# EAGLE schematic robotdriver (EAGLE 8.3.2)
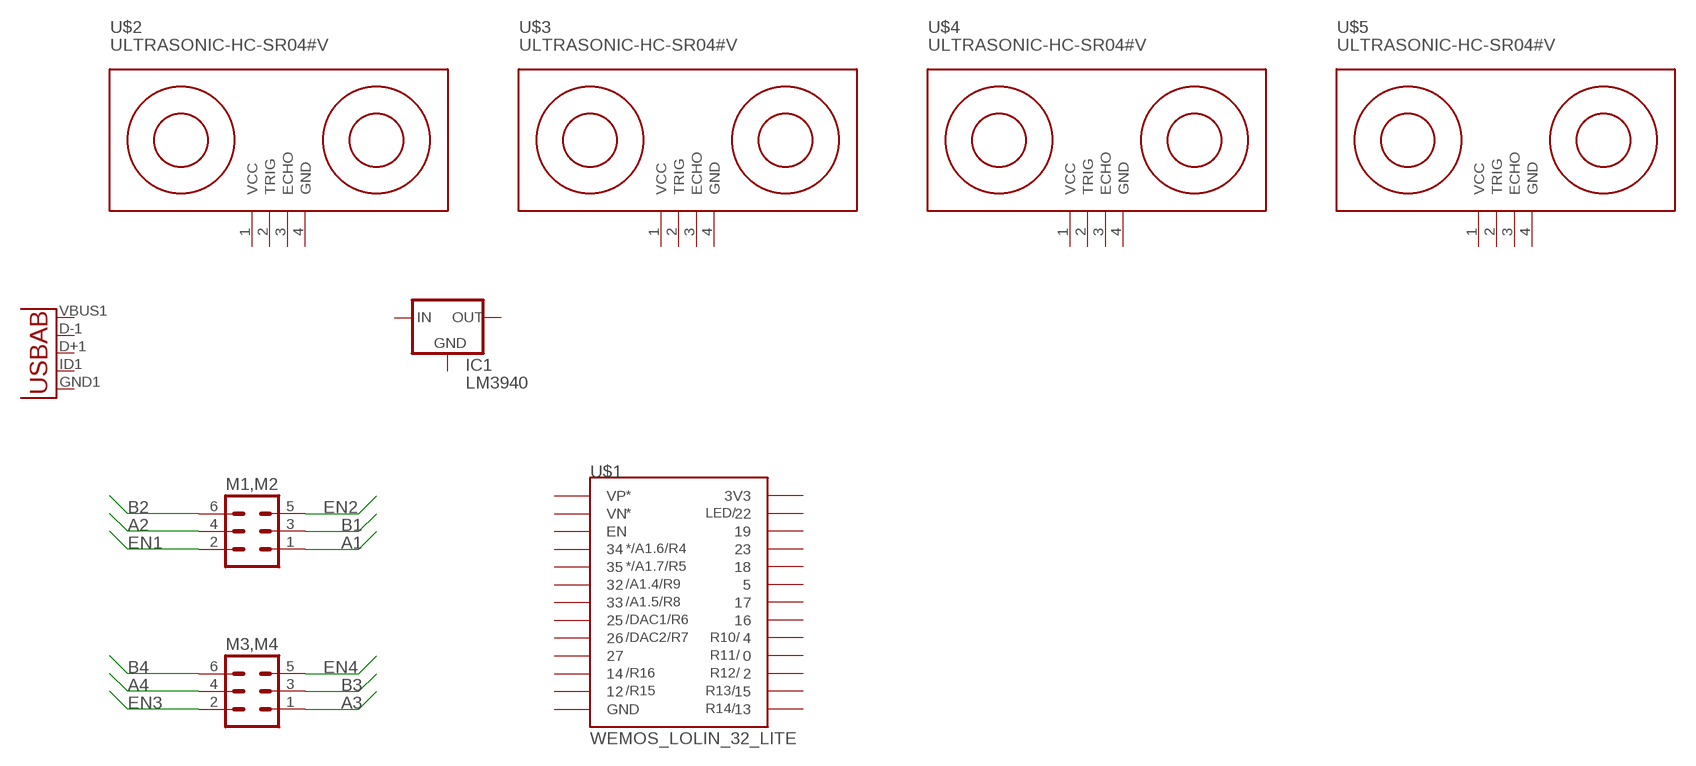
[diagram p0: schematic, sheet 1]

## Parts
IC1  LM3940  78XXS  [78XXS]
M1,M2  ML6  [ML6]
M3,M4  ML6  [ML6]
U1  USB""  [USB-MICRO-SMD]
U$1  WEMOS_LOLIN_32_LITE  [WEMOS_LOLIN_32_LITE]
U$2  ULTRASONIC-HC-SR04#V  [ULTRASONIC-HC-SR04#V]
U$3  ULTRASONIC-HC-SR04#V  [ULTRASONIC-HC-SR04#V]
U$4  ULTRASONIC-HC-SR04#V  [ULTRASONIC-HC-SR04#V]
U$5  ULTRASONIC-HC-SR04#V  [ULTRASONIC-HC-SR04#V]

## Nets
A1: M1,M2.1
A2: M1,M2.4
A3: M3,M4.1
A4: M3,M4.4
B1: M1,M2.3
B2: M1,M2.6
B3: M3,M4.3
B4: M3,M4.6
EN1: M1,M2.2
EN2: M1,M2.5
EN3: M3,M4.2
EN4: M3,M4.5
Unconnected: IC1.GND IC1.IN IC1.OUT U1.D+1(D+) U1.D-1(D-) U1.GND1(GND) U1.ID1(USBID) U1.VBUS1(VBUS) U$1.0 U$1.2 U$1.4 U$1.5 U$1.12 U$1.13 U$1.14 U$1.15 U$1.16 U$1.17 U$1.18 U$1.19 U$1.22 U$1.23 U$1.25 U$1.26 U$1.27 U$1.32 U$1.33 U$1.34 U$1.35 U$1.EN U$1.VN U$1.VP U$2.2(TRIG) U$2.3(ECHO) U$3.2(TRIG) U$3.3(ECHO) U$4.2(TRIG) U$4.3(ECHO) U$5.2(TRIG) U$5.3(ECHO)

## Power pins joined to a net without a drawn wire
3V3: U$1.3V3
GND: U$1.GND U$2.4(GND) U$3.4(GND) U$4.4(GND) U$5.4(GND)
VCC: U$2.1(VCC) U$3.1(VCC) U$4.1(VCC) U$5.1(VCC)

## Library data of the parts
IC1 = v-reg:78XXS: VOLTAGE REGULATOR
M1,M2 M3,M4 = con-harting-ml:ML6: HARTING; OC_FARNELL: unknown; OC_NEWARK: unknown
U1 = MicroUSB:USB: This is a USB AB connector that is compatible with USB OTG. i.e. this connector can serve as a host or device
U$1 = WiFi-devkits:WEMOS_LOLIN_32_LITE: Wemos LOLIN 32 Lite - ESP32 Author: Martin Vagovszky
U$2-U$5 = diy-modules:ULTRASONIC-HC-SR04: Ultrasonic Ranging Module HC-SR04 More details available here: http://randomnerdtutorials.com/complete-guide-for-ultrasonic-sensor-hc-sr04/ Click here to find device on ebay.com <http://www.ebay.com/sch/hc+sr04+ultrasonic>